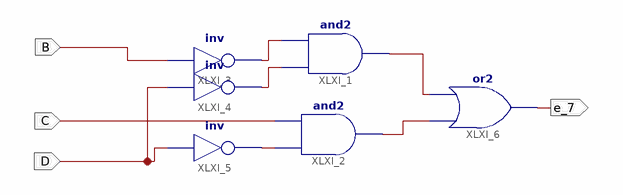
[diagram p0: schematic sheet 1]
// Xilinx ISE schematic e_7.sch (spartan6) as structural Verilog: 6 symbols, 4 ports
module e_7 (
  input  B,
  input  D,
  input  C,
  output e_7
);

  wire XLXN_7, XLXN_8, XLXN_9, XLXN_13, XLXN_14;

  and XLXI_1 (XLXN_13, XLXN_8, XLXN_7);
  and XLXI_2 (XLXN_14, XLXN_9, C);
  not XLXI_3 (XLXN_7, B);
  not XLXI_4 (XLXN_8, D);
  not XLXI_5 (XLXN_9, D);
  or XLXI_6 (e_7, XLXN_14, XLXN_13);
endmodule
